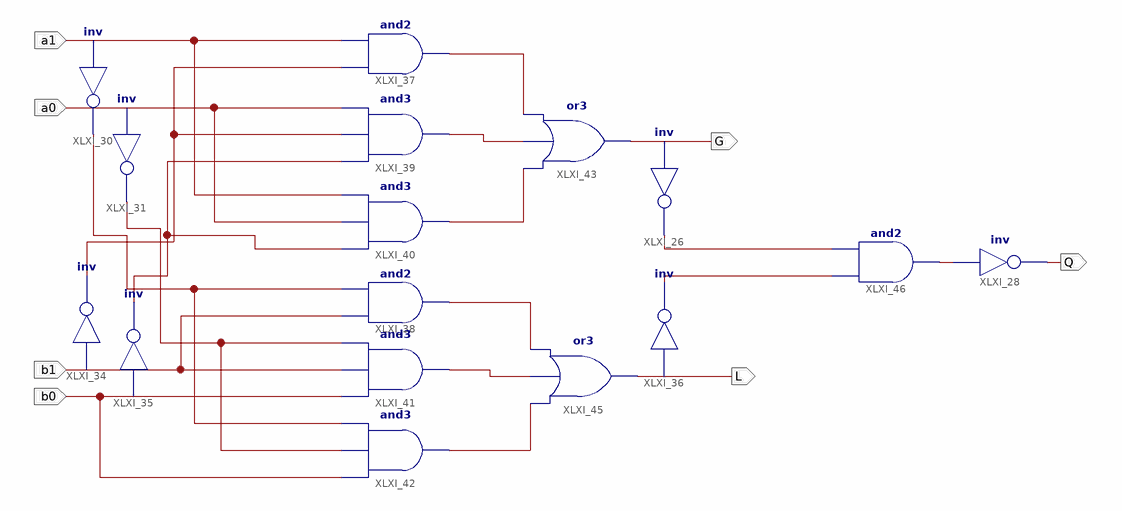
[diagram p0: schematic sheet 1]
// Xilinx ISE schematic Lab_E_2bitcomparator_Schematic.sch (artix7) as structural Verilog: 16 symbols, 7 ports
module Lab_E_2bitcomparator_Schematic (
  input  a1,
  input  a0,
  input  b1,
  input  b0,
  output G,
  output L,
  output Q
);

  wire XLXN_11, XLXN_12, XLXN_13, XLXN_19, XLXN_20, XLXN_21, XLXN_24, XLXN_30, XLXN_31, XLXN_37, XLXN_38,
       XLXN_40, XLXN_41;

  not XLXI_26 (XLXN_40, G);
  not XLXI_28 (Q, XLXN_24);
  not XLXI_30 (XLXN_38, a1);
  not XLXI_31 (XLXN_37, a0);
  not XLXI_34 (XLXN_30, b1);
  not XLXI_35 (XLXN_31, b0);
  not XLXI_36 (XLXN_41, L);
  and XLXI_37 (XLXN_11, XLXN_30, a1);
  and XLXI_38 (XLXN_19, b1, XLXN_38);
  and XLXI_39 (XLXN_12, XLXN_31, XLXN_30, a0);
  and XLXI_40 (XLXN_13, XLXN_31, a0, a1);
  and XLXI_41 (XLXN_20, b0, b1, XLXN_37);
  and XLXI_42 (XLXN_21, b0, XLXN_37, XLXN_38);
  or XLXI_43 (G, XLXN_13, XLXN_12, XLXN_11);
  or XLXI_45 (L, XLXN_21, XLXN_20, XLXN_19);
  and XLXI_46 (XLXN_24, XLXN_41, XLXN_40);
endmodule
